# EAGLE schematic Scheme (EAGLE 7.2.0)
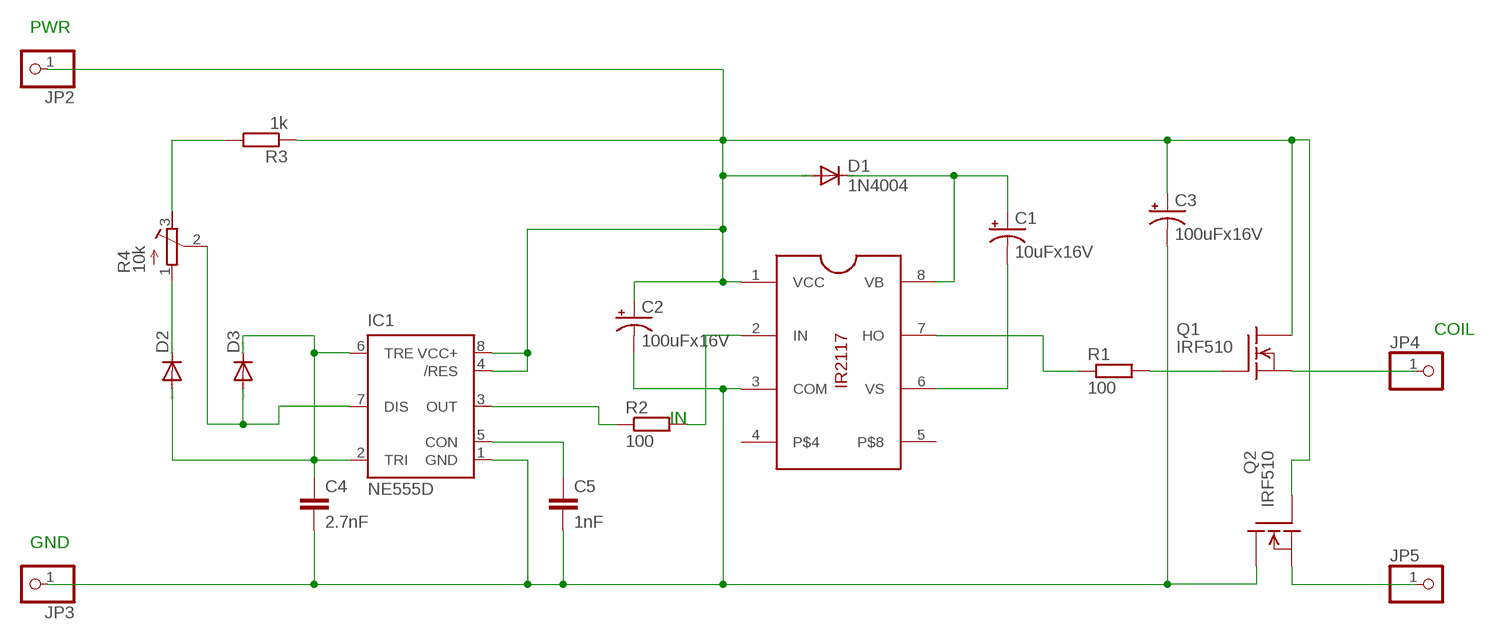
[diagram p0: schematic, sheet 1]

## Parts
C1  10uFx16V  CPOL-USSMCD  [SMC_D]
C2  100uFx16V  CPOL-USSMCD  [SMC_D]
C3  100uFx16V  CPOL-USSMCD  [SMC_D]
C4  2.7nF  C5/4.5  [C5B4.5]
C5  1nF  C5/4.5  [C5B4.5]
D1  1N4004  [DO41-10]
D2  DIODE-SOD106A-R  [SOD106A-R]
D3  DIODE-SOD106A-R  [SOD106A-R]
IC1  NE555D  [SO08]
JP2  PINHD-1X1  [1X01]
JP3  PINHD-1X1  [1X01]
JP4  PINHD-1X1  [1X01]
JP5  PINHD-1X1  [1X01]
Q1  IRF510  [TO220]
Q2  IRF510  [TO220]
R1  100  R-EU_0207/15  [0207/15]
R2  100  R-EU_R1206  [R1206]
R3  1k  R-EU_0207/15  [0207/15]
R4  10k  R-TRIMM3339P  [RTRIM3339P]
U$1  IR2117SPBF  [SO8]

## Nets
N$1: Q1.1(G) R1.2
N$2: R1.1 U$1.7(HO)
N$4: C1.+ D1.C U$1.8(VB)
N$5: C1.- U$1.6(VS)
N$6: C2.- C3.- C4.2 C5.2 IC1.1(GND) JP3.1 Q2.2(D) U$1.3(COM)
N$7: R2.2 U$1.2(IN)
N$8: JP4.1 Q1.3(S)
N$9: D3.A IC1.7(DIS) R4.2(S)
N$10: JP5.1 Q2.3(S)
N$11: IC1.3(OUT) R2.1
N$12: C4.1 D2.A D3.C IC1.2(TRI) IC1.6(TRE)
N$13: C5.1 IC1.5(CON)
N$14: D2.C R4.1(A)
N$15: R3.2 R4.3(E)
N$17: C2.+ C3.+ D1.A IC1.4(/RES) IC1.8(VCC+) JP2.1 Q1.2(D) Q2.1(G) R3.1 U$1.1(VCC)
Unconnected: U$1.4 U$1.5

## Notes on the sheet
- PWR
- COIL
- IN
- GND

## Library data of the parts
C1-C3 = rcl:CPOL-US: POLARIZED CAPACITOR, American symbol
C4 C5 = capacitor-wima:C: CAPACITOR naming: grid - package width
D1 = diode:1N4004: DIODE general purpose rectifier, 1 A
D2 D3 = diode:DIODE-: DIODE
IC1 = SparkFun:NE555: General purpose bipolar Timer
JP2-JP5 = adafruit:PINHD-1X1: Pin header 1x1 for 0.1" spacing With round pins
Q1 Q2 = transistor-fet:IRF510: N-Channel Enhancement MOSFET (HEXFET); 100V; 5,6A; 0,54Ohm
R1-R3 = resistor:R-EU_: RESISTOR, European symbol
R4 = resistor:R-TRIMM: Trimm resistor
U$1 = mosfet_drivers:IR2117SPBF